# EasyEDA Pro project ProPrj_Practice 4 layer_2025-09-09.epro, schematic Uni Digital In
Board Name: Universal Digital Input; Create Date: 2025-08-12; Page Name: P1; Project Name: Practice 4 layer; Schematic Name: Uni Digital In; Update Date: 2025-08-21; Company: EasyEDA.com; Page Size: A4; Version: V1.0
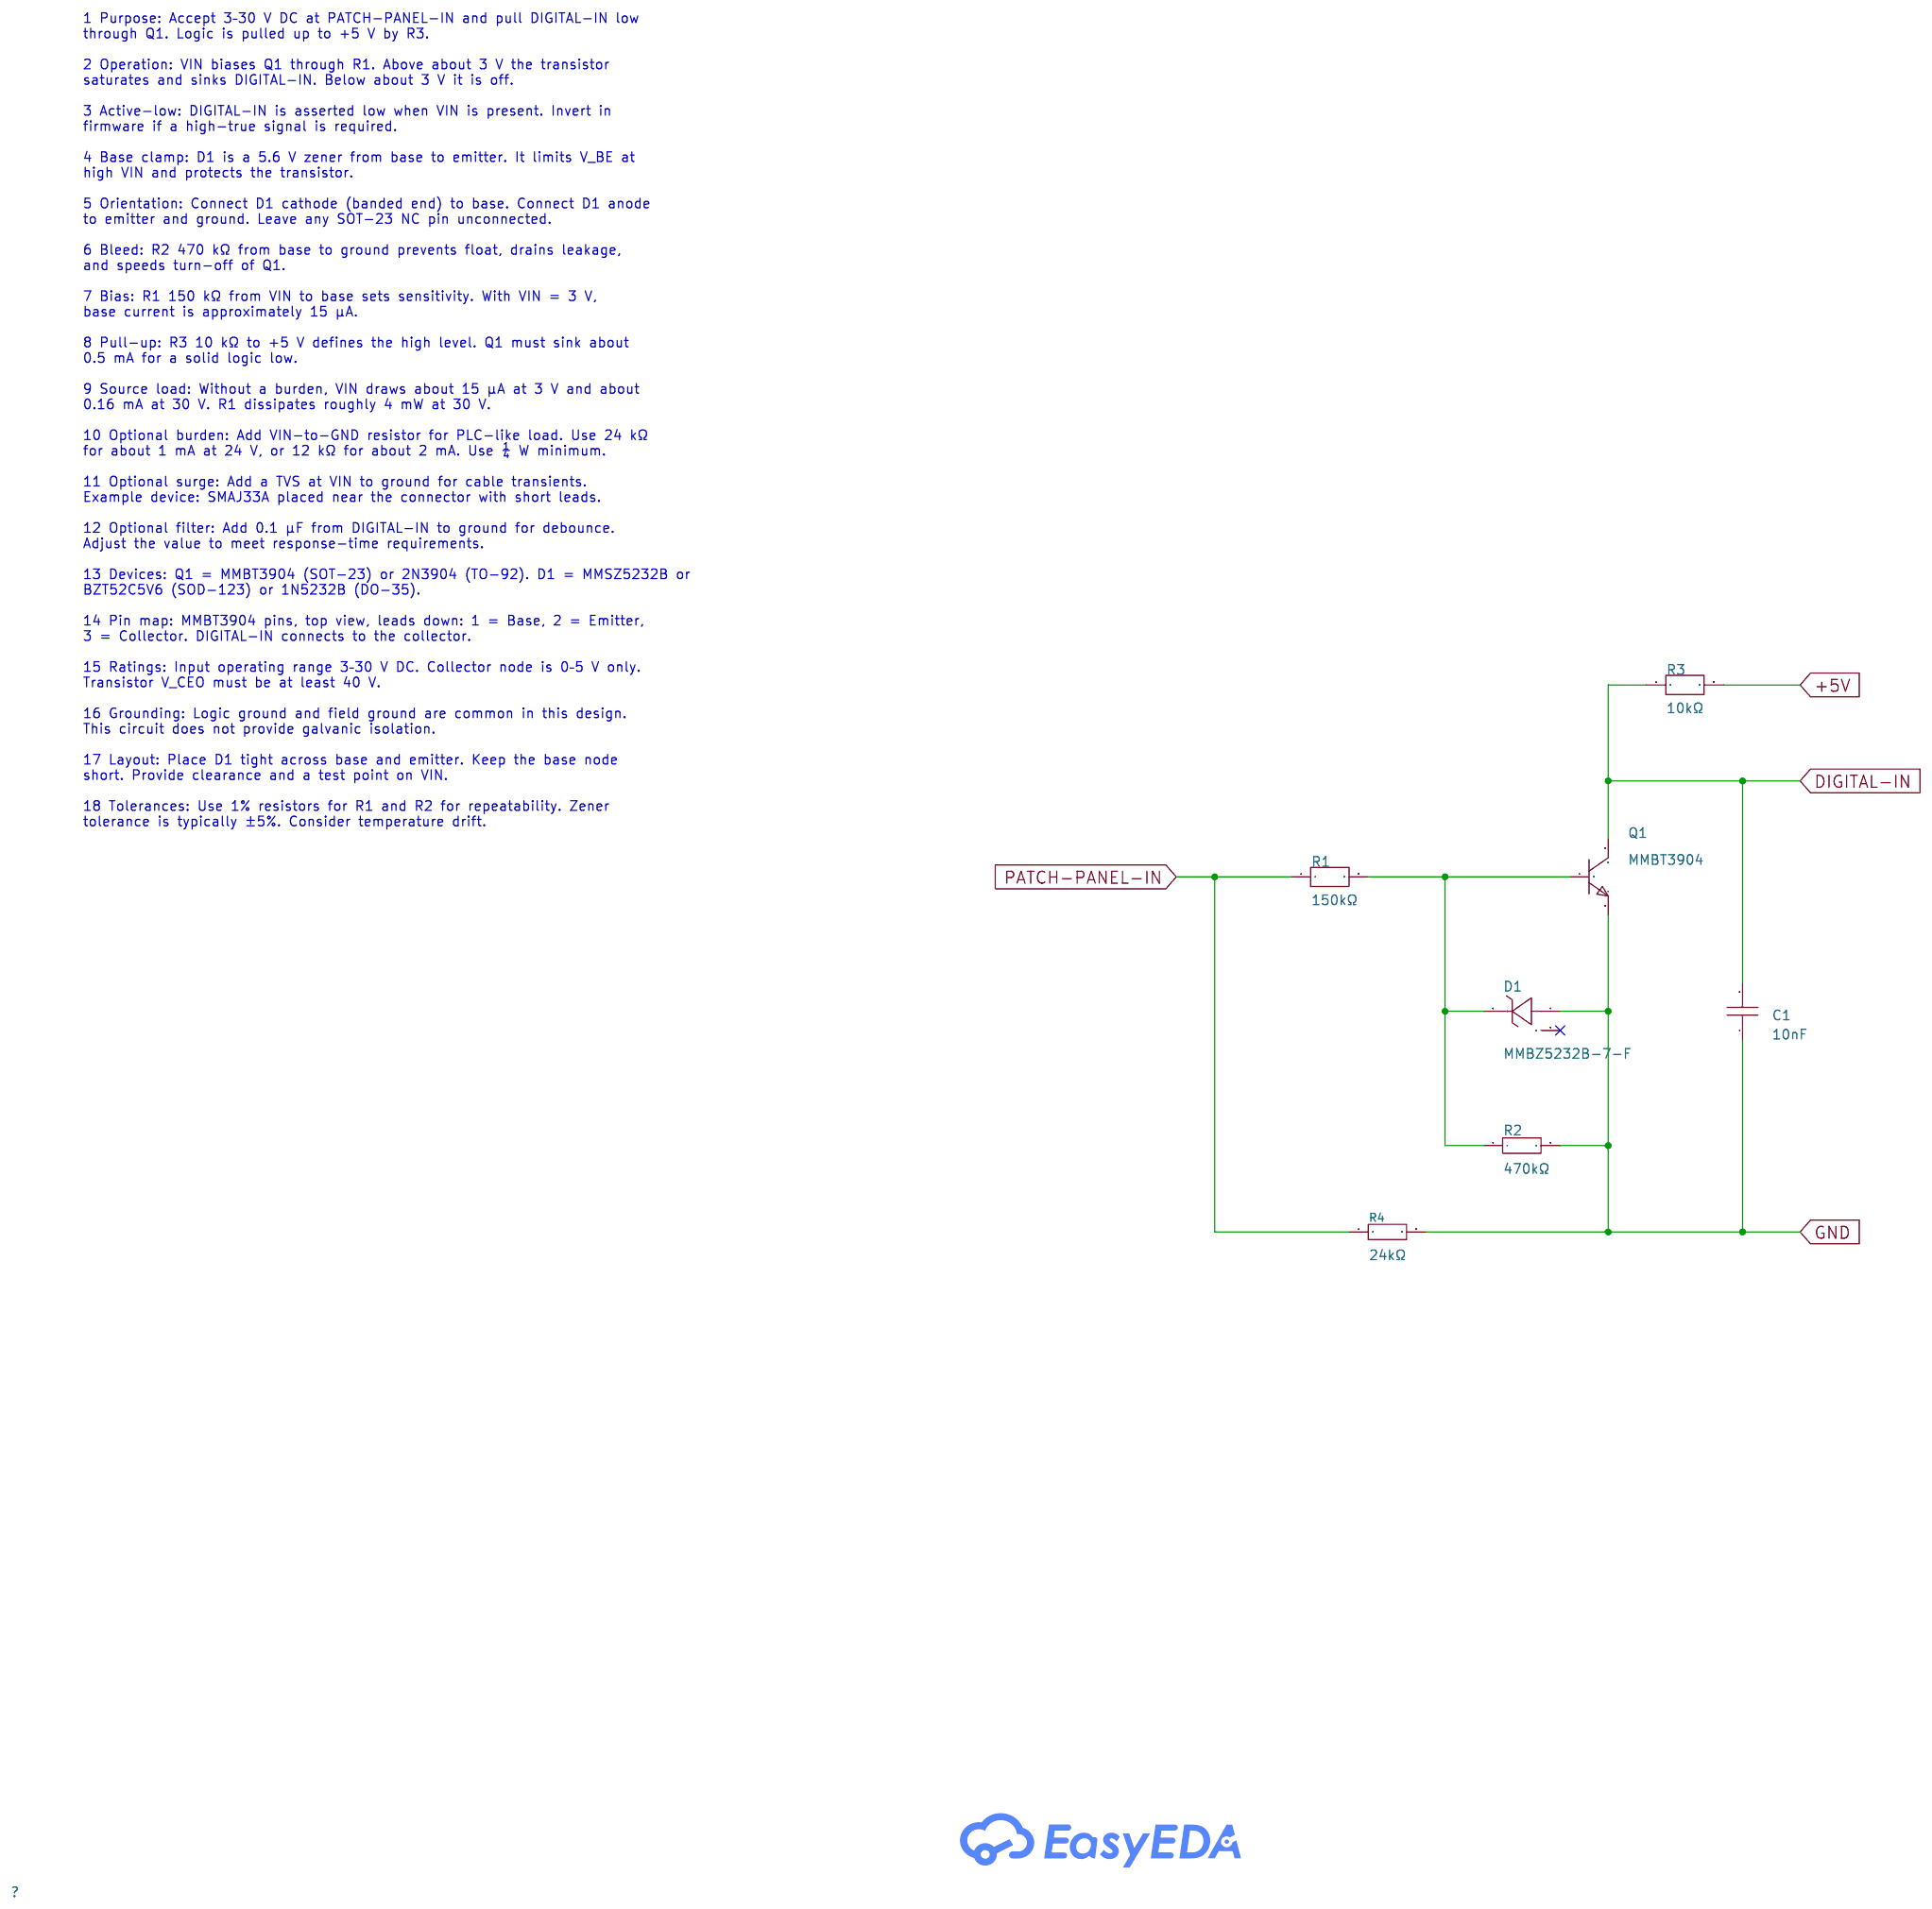
[diagram p1: schematic sheet]

## Parts
C1  10nF  [C0603]
D1  MMBZ5232B-7-F  [SOT-23-3_L2.9-W1.3-P1.90-LS2.4-BR]
Q1  MMBT3904  [SOT-23-3_L2.9-W1.3-P1.90-LS2.4-BR]
R1  150kΩ  [R0603]
R2  470kΩ  [R0603]
R3  10kΩ  [R0603]
R4  24kΩ  [R0603]

## Library data of the parts
C1 = CL10B103KB8NNNC: Capacitance: Tolerance:±10% Tolerance:±10% Voltage Rated: Temperature Coefficient:; LCSC Part Name: 10nF ±10% 50V; Supplier Part: C1589; Manufacturer: SAMSUNG(三星); Supplier Footprint: 0603; JLCPCB Part Class: Extended Part; Datasheet: https://atta.szlcsc.com/upload/public/pdf/source/20160218/1457707763339.pdf; Supplier: LCSC; Tolerance: ±10%
D1 = MMBZ5232B-7-F: Diode Configuration:Independent Zener Voltage(Nom):5.6V Reverse Leakage Current (Ir):5uA@3V Zener Voltage(Range):5.32V~5.88V Zener Voltage(Range):5.32V~5.88V Pd - Power Dissipation:350mW Impedance(Zzt):11Ω Operating Junction Temperature Range:-65℃~+150℃ O; LCSC Part Name: 齐纳二极管 5.6V 350mW; Supplier Part: C260870; Manufacturer: DIODES(美台); Supplier Footprint: SOT-23; JLCPCB Part Class: Extended Part; Datasheet: https://item.szlcsc.com/datasheet/MMBZ5232B-7-F/252734.html; Supplier: LCSC; Diode Configuration: Independent; Zener Voltage(Nom): 5.6V; Reverse Leakage Current (Ir): 5uA@3V; Zener Voltage(Range): 5.32V~5.88V; Pd - Power Dissipation: 350mW; Impedance(Zzt): 11Ω; Operating Junction Temperature Range: -65℃~+150℃
Q1 = MMBT3904_C22374713: Supplier Part: C22374713; Manufacturer: DOWO(东沃); Supplier Footprint: SOT-23; JLCPCB Part Class: Extended Part; Datasheet: https://atta.szlcsc.com/upload/public/pdf/source/20240402/5DDCD9F172A0F6C20D9FAF0C25C6F6AF.pdf; Supplier: LCSC
R1 = FRC0603F1503TS: Type:Thick Film Resistors Resistance:150kΩ Tolerance:±1% Tolerance:±1% Power(Watts): Overload Voltage (Max): Temperature Coefficient:±100ppm/℃ Temperature Coefficient:±100ppm/℃ Operating Temperature Range:-55℃~+155℃ Operating Temperature Range:-55℃~+155℃; LCSC Part Name: 150kΩ ±1% 100mW 厚膜电阻; Supplier Part: C2906993; Manufacturer: FOJAN(富捷); Supplier Footprint: 0603; JLCPCB Part Class: Extended Part; Datasheet: https://atta.szlcsc.com/upload/public/pdf/source/20211221/925EC7D7225764EE0046F22065062C87.pdf; Supplier: LCSC; Type: Thick Film Resistors; Tolerance: ±1%; Temperature Coefficient: ±100ppm/℃; Operating Temperature Range: -55℃~+155℃
R2 = RC0603FR-07470KL: Type:Thick Film Resistor Resistance:470kΩ Tolerance:±1% Tolerance:±1% Power(Watts):100mW Voltage-Supply(Max):75V Temperature Coefficient:±100ppm/℃ Temperature Coefficient:±100ppm/℃ Operating Temperature:-55℃~+155℃ Operating Temperature:-55℃~+155℃; LCSC Part Name: 厚膜电阻 470kΩ ±1% 100mW; Supplier Part: C114622; Manufacturer: YAGEO(国巨); Supplier Footprint: 0603; JLCPCB Part Class: Extended Part; Datasheet: https://atta.szlcsc.com/upload/public/pdf/source/20250610/89E4D743C004A82A45145C7A2CC3A578.pdf; Supplier: LCSC; Type: Thick Film Resistor; Tolerance: ±1%; Power(Watts): 100mW; Voltage-Supply(Max): 75V; Temperature Coefficient: ±100ppm/℃; Operating Temperature: -55℃~+155℃
R3 = FRC0603J103 TS: Type:Thick Film Resistors Resistance:10kΩ Tolerance:±5% Tolerance:±5% Power(Watts):0.1W Voltage-Supply(Max):75V Temperature Coefficient:±100ppm/℃ Temperature Coefficient:±100ppm/℃ Operating Temperature:-55℃~+155℃ Operating Temperature:-55℃~+155℃; LCSC Part Name: 10kΩ ±5% 100mW 厚膜电阻; Supplier Part: C2930027; Manufacturer: FOJAN(富捷); Supplier Footprint: 0603; JLCPCB Part Class: Extended Part; Datasheet: https://atta.szlcsc.com/upload/public/pdf/source/20211221/925EC7D7225764EE0046F22065062C87.pdf; Supplier: LCSC; Type: Thick Film Resistors; Tolerance: ±5%; Power(Watts): 0.1W; Voltage-Supply(Max): 75V; Temperature Coefficient: ±100ppm/℃; Operating Temperature: -55℃~+155℃
R4 = 0603WAF2402T5E: Type:Thick Film Resistors Resistance:24kΩ Tolerance:±1% Tolerance:±1% Power(Watts): Overload Voltage (Max): Temperature Coefficient:±100ppm/℃ Temperature Coefficient:±100ppm/℃ Operating Temperature Range:-55℃~+155℃ Operating Temperature Range:-55℃~+155℃; LCSC Part Name: 24kΩ ±1% 100mW 厚膜电阻; Supplier Part: C23352; Manufacturer: UNI-ROYAL(厚声); Supplier Footprint: 0603; JLCPCB Part Class: Basic Part; Datasheet: https://atta.szlcsc.com/upload/public/pdf/source/20200306/C422600_1E6D84923E4A46A82E41ADD87F860B5C.pdf; Supplier: LCSC; Type: Thick Film Resistors; Tolerance: ±1%; Temperature Coefficient: ±100ppm/℃; Operating Temperature Range: -55℃~+155℃

## Nets
+5V: R3.2
GND: C1.1 D1.1(A) Q1.2(E) R2.2 R4.2
DIGITAL-IN: C1.2 Q1.3(C) R3.1
PATCH-PANEL-IN: R1.1 R4.1
T_BASE: D1.3(C) Q1.1(B) R1.2 R2.1

Not connected (* = marked no-connect by the designer): D1 2(NC)*

## Notes on the sheet
- 1 Purpose: Accept 3–30 V DC at PATCH-PANEL-IN and pull DIGITAL-IN low
  through Q1. Logic is pulled up to +5 V by R3.
  2 Operation: VIN biases Q1 through R1. Above about 3 V the transistor
  saturates and sinks DIGITAL-IN. Below about 3 V it is off.
  3 Active-low: DIGITAL-IN is asserted low when VIN is present. Invert in
  firmware if a high-true signal is required.
  4 Base clamp: D1 is a 5.6 V zener from base to emitter. It limits V_BE at
  high VIN and protects the transistor.
  5 Orientation: Connect D1 cathode (banded end) to base. Connect D1 anode
  to emitter and ground. Leave any SOT-23 NC pin unconnected.
  6 Bleed: R2 470 kΩ from base to ground prevents float, drains leakage,
  and speeds turn-off of Q1.
  7 Bias: R1 150 kΩ from VIN to base sets sensitivity. With VIN = 3 V,
  base current is approximately 15 µA.
  8 Pull-up: R3 10 kΩ to +5 V defines the high level. Q1 must sink about
  0.5 mA for a solid logic low.
  9 Source load: Without a burden, VIN draws about 15 µA at 3 V and about
  0.16 mA at 30 V. R1 dissipates roughly 4 mW at 30 V.
  10 Optional burden: Add VIN-to-GND resistor for PLC-like load. Use 24 kΩ
  for about 1 mA at 24 V, or 12 kΩ for about 2 mA. Use ¼ W minimum.
  11 Optional surge: Add a TVS at VIN to ground for cable transients.
  Example device: SMAJ33A placed near the connector with short leads.
  12 Optional filter: Add 0.1 µF from DIGITAL-IN to ground for debounce.
  Adjust the value to meet response-time requirements.
  13 Devices: Q1 = MMBT3904 (SOT-23) or 2N3904 (TO-92). D1 = MMSZ5232B or
  BZT52C5V6 (SOD-123) or 1N5232B (DO-35).
  14 Pin map: MMBT3904 pins, top view, leads down: 1 = Base, 2 = Emitter,
  3 = Collector. DIGITAL-IN connects to the collector.
  15 Ratings: Input operating range 3–30 V DC. Collector node is 0–5 V only.
  Transistor V_CEO must be at least 40 V.
  16 Grounding: Logic ground and field ground are common in this design.
  This circuit does not provide galvanic isolation.
  17 Layout: Place D1 tight across base and emitter. Keep the base node
  short. Provide clearance and a test point on VIN.
  18 Tolerances: Use 1% resistors for R1 and R2 for repeatability. Zener
  tolerance is typically ±5%. Consider temperature drift.
